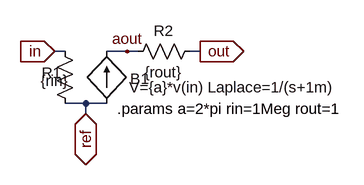
[diagram p0: schematic integrator.asc]
integrator.asc, the LTspice schematic file:
Version 4
SHEET 1 880 680
WIRE 16 112 0 112
WIRE 48 192 16 192
WIRE 48 208 48 192
WIRE 80 192 48 192
WIRE 112 112 80 112
WIRE 128 112 112 112
WIRE 224 112 208 112
FLAG 0 112 in
IOPIN 0 112 In
FLAG 224 112 out
IOPIN 224 112 Out
FLAG 48 208 ref
IOPIN 48 208 BiDir
FLAG 112 112 aout
SYMBOL res 0 96 R0
WINDOW 3 -21 61 Left 0
WINDOW 0 -20 49 Left 0
SYMATTR Value {rin}
SYMATTR InstName R1
SYMBOL res 224 96 R90
WINDOW 0 0 56 VBottom 0
WINDOW 3 32 56 VTop 0
SYMATTR InstName R2
SYMATTR Value {rout}
SYMBOL bi2 80 112 R0
WINDOW 0 36 42 Left 0
WINDOW 3 35 55 Left 0
SYMATTR InstName B1
SYMATTR Value V={a}*v(in) Laplace=1/(s+1m)
TEXT 96 200 Left 0 !.params a=2*pi rin=1Meg rout=1

The netlist it stands for:
* integrator.asc
R1 in ref {rin}
R2 out aout {rout}
B1 ref aout V={a}*v(in) Laplace=1/(s+1m)
.params a=2*pi rin=1Meg rout=1
.backanno
.end